# EasyEDA Pro project FOC_drive.epro, schematic Schematic9
Board Name: cbt6驱动; Create Date: 2025-10-11; Page Name: P1; Project Name: stm32g431_foc; Schematic Name: Schematic9; Update Date: 2025-10-11; Company: 嘉立创EDA; Page Size: A4; Version: V1.0
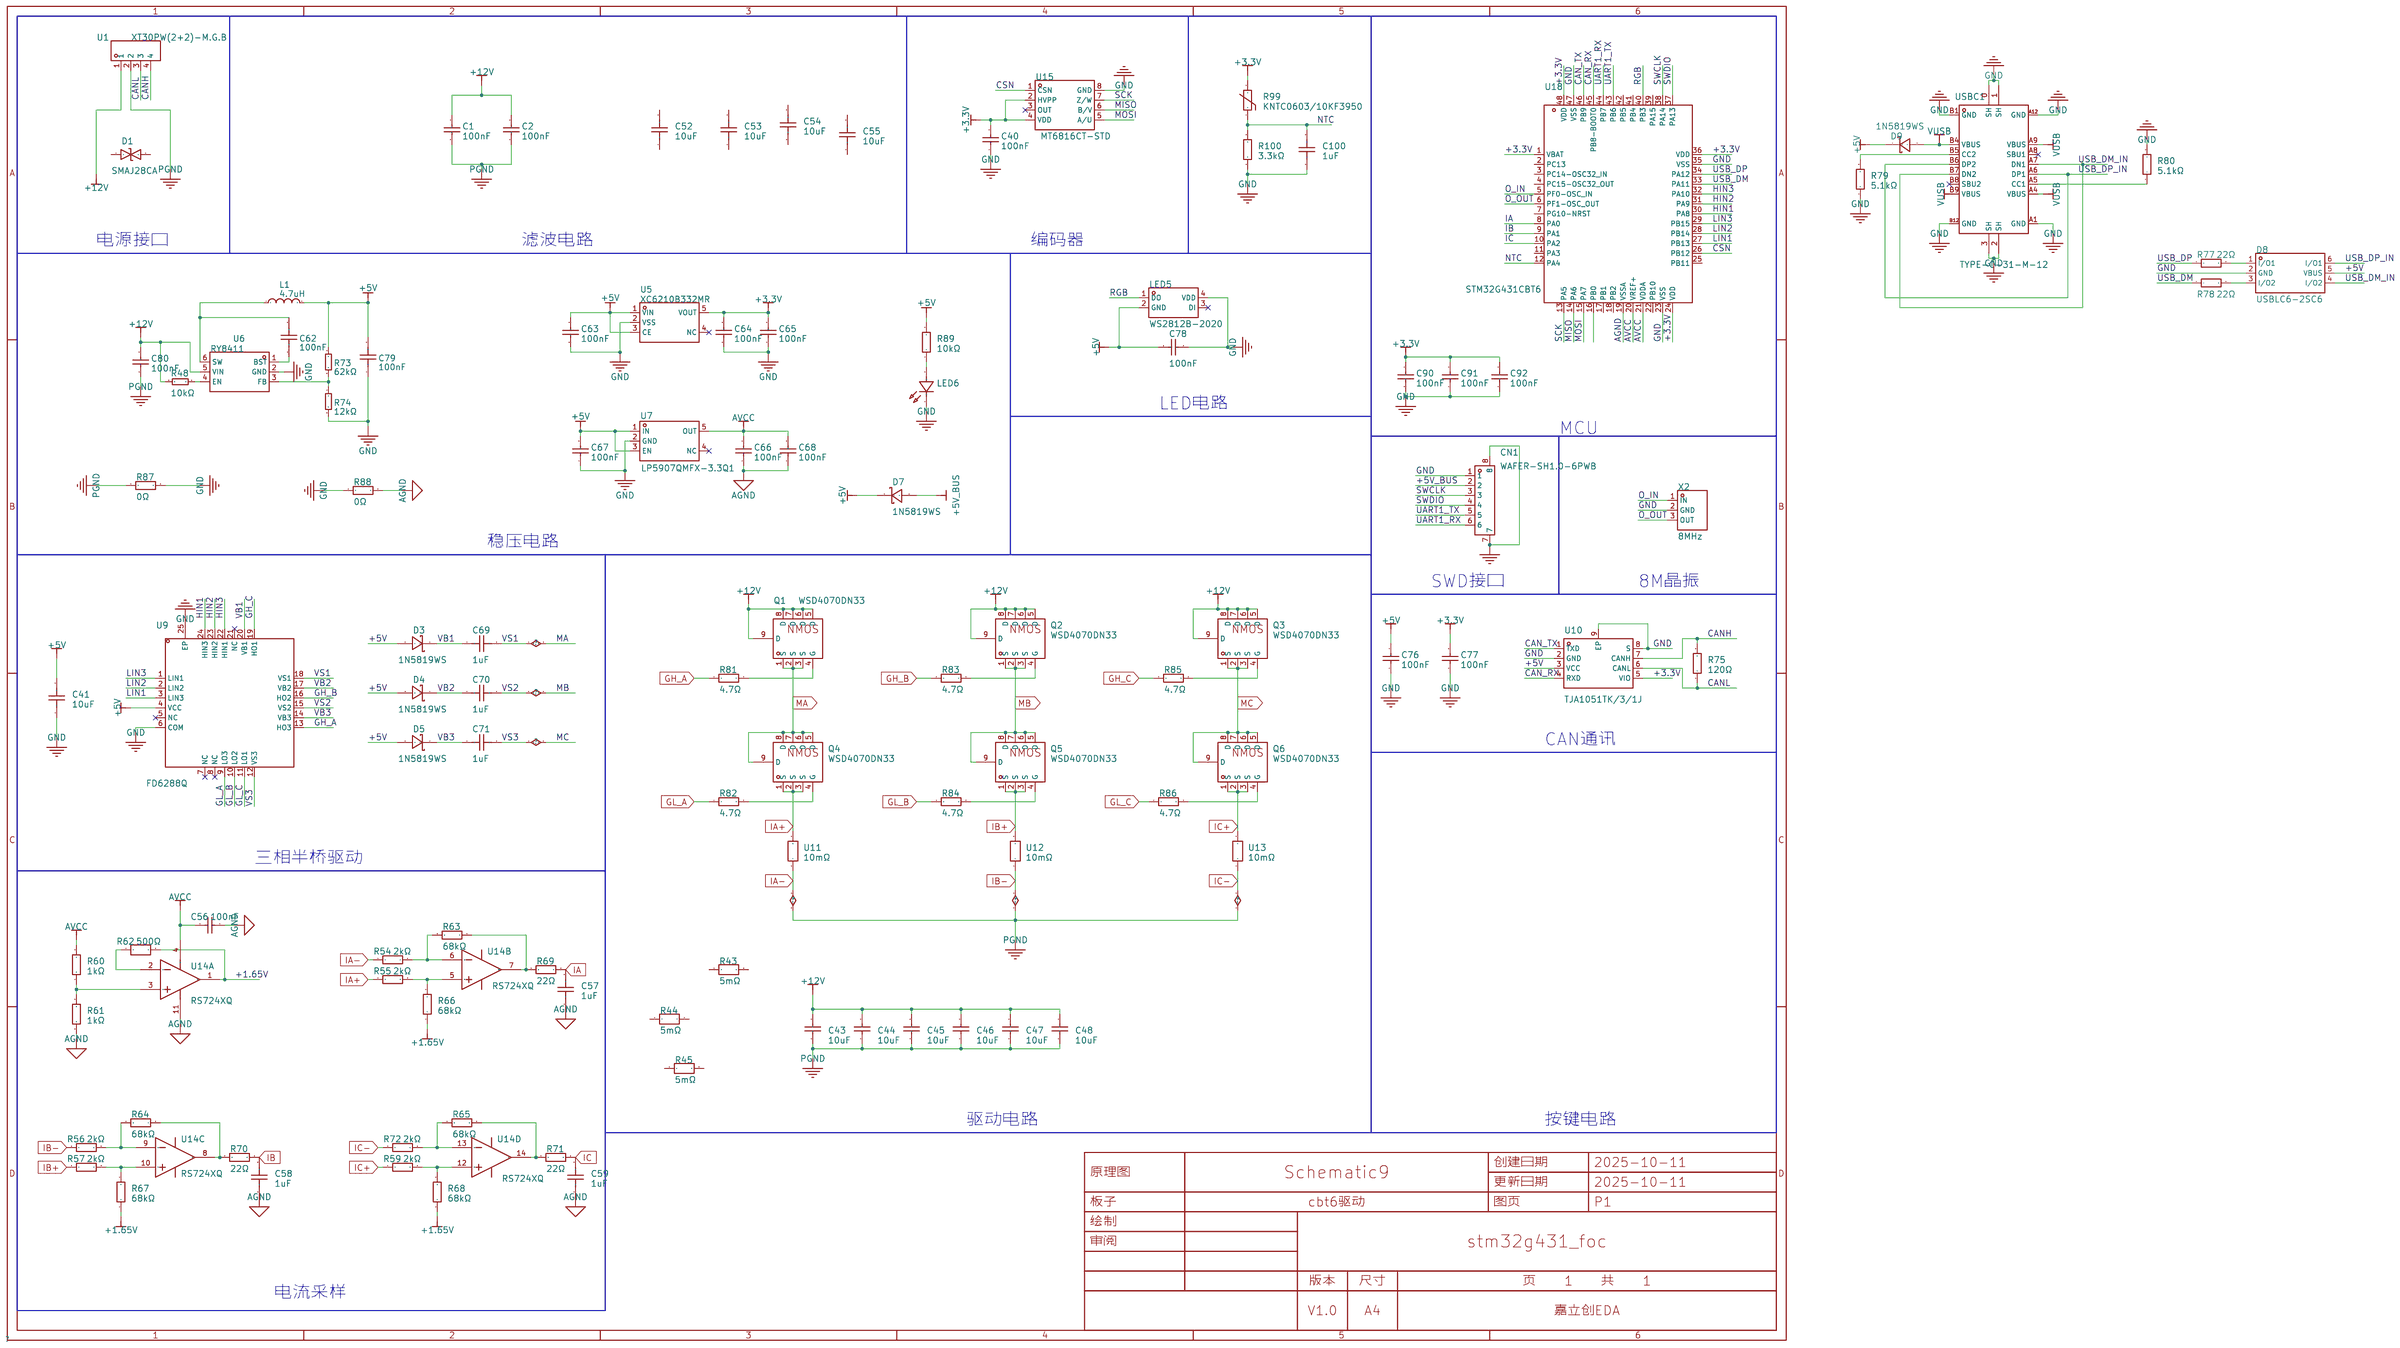
[diagram p0: schematic sheet]

## Parts
C1  100nF  [C0603_S]
C2  100nF  [C0603_S]
C40  100nF  [C0603_S]
C41  10uF  [C0603_S]
C43  10uF  [C1206_SMALL]
C44  10uF  [C1206_SMALL]
C45  10uF  [C1206_SMALL]
C46  10uF  [C1206_SMALL]
C47  10uF  [C1206_SMALL]
C48  10uF  [C1206_SMALL]
C52  10uF  [C1206]
C53  10uF  [C1206]
C54  10uF  [C1206]
C55  10uF  [C1206]
C56  100nF  [C0603_S]
C57  1uF  [C0603_S_1]
C58  1uF  [C0603_S_1]
C59  1uF  [C0603_S_1]
C62  100nF  [C0603_S_3]
C63  100nF  [C0603_S]
C64  100nF  [C0603_S]
C65  100nF  [C0603_S]
C66  100nF  [C0603_S]
C67  100nF  [C0603_S]
C68  100nF  [C0603_S]
C69  1uF  [C0603S]
C70  1uF  [C0603S]
C71  1uF  [C0603S]
C76  100nF  [C0603_S]
C77  100nF  [C0603_S]
C78  100nF  [C0603_S]
C79  100nF  [C0603_S_3]
C80  100nF  [C0603_S]
C90  100nF  [C0603_S]
C91  100nF  [C0603_S]
C92  100nF  [C0603_S]
C100  1uF  [C0603_S]
CN1  WAFER-SH1.0-6PWB  [CONN-SMD_6P-P1.00_XUNPU_WAFER-SH1.0-6PWB]
D1  SMAJ28CA  [SMA_L4.3-W2.5-LS5.0-BI]
D3  1N5819WS  [SOD-323_L1.8-W1.3-LS2.5-RD]
D4  1N5819WS  [SOD-323_L1.8-W1.3-LS2.5-RD]
D5  1N5819WS  [SOD-323_L1.8-W1.3-LS2.5-RD]
D7  1N5819WS  [SOD-323_L1.8-W1.3-LS2.5-RD]
D8  USBLC6-2SC6  [SOT-23-6_L2.9-W1.6-P0.95-LS2.8-BL]
D9  1N5819WS  [SOD-323_L1.8-W1.3-LS2.5-RD]
L1  4.7uH  [IND-SMD_L2.5-W2.0]
LED5  WS2812B-2020  [LED-SMD_4P-L2.0-W2.0-TL_WS2812B-2020]
LED6  XL-1608UBC-04  [LED0603-RD_BLUE]
Q1  WSD4070DN33  [PDFN3333-8_L3.1-W3.2-P0.65-LS3.4-BL]
Q2  WSD4070DN33  [PDFN3333-8_L3.1-W3.2-P0.65-LS3.4-BL]
Q3  WSD4070DN33  [PDFN3333-8_L3.1-W3.2-P0.65-LS3.4-BL]
Q4  WSD4070DN33  [PDFN3333-8_L3.1-W3.2-P0.65-LS3.4-BL]
Q5  WSD4070DN33  [PDFN3333-8_L3.1-W3.2-P0.65-LS3.4-BL]
Q6  WSD4070DN33  [PDFN3333-8_L3.1-W3.2-P0.65-LS3.4-BL]
R43  5mΩ  [R0805]
R44  5mΩ  [R0805]
R45  5mΩ  [R0805]
R48  10kΩ  [R0603_S]
R54  2kΩ  [R0603_S]
R55  2kΩ  [R0603_S]
R56  2kΩ  [R0603_S]
R57  2kΩ  [R0603_S]
R59  2kΩ  [R0603_S]
R60  1kΩ  [R0603_S]
R61  1kΩ  [R0603_S]
R62  500Ω  [R0603_S]
R63  68kΩ  [R0603_S]
R64  68kΩ  [R0603_S]
R65  68kΩ  [R0603_S]
R66  68kΩ  [R0603_S]
R67  68kΩ  [R0603_S]
R68  68kΩ  [R0603_S]
R69  22Ω  [R0603_S]
R70  22Ω  [R0603_S]
R71  22Ω  [R0603_S]
R72  2kΩ  [R0603_S]
R73  62kΩ  [R0603_S]
R74  12kΩ  [R0603_S]
R75  120Ω  [R0603_S]
R77  22Ω  [R0603_SMALL]
R78  22Ω  [R0603_SMALL]
R79  5.1kΩ  [R0603_SMALL]
R80  5.1kΩ  [R0603_SMALL]
R81  4.7Ω  [R0603_S]
R82  4.7Ω  [R0603_S]
R83  4.7Ω  [R0603_S]
R84  4.7Ω  [R0603_S]
R85  4.7Ω  [R0603_S]
R86  4.7Ω  [R0603_S]
R87  0Ω  [R0603_S]
R88  0Ω  [R0603_S]
R89  10kΩ  [R0603_SMALL]
R99  KNTC0603/10KF3950  [R0603_SMALL]
R100  3.3kΩ  [R0603_SMALL]
U1  XT30PW(2+2)-M.G.B  [CONN-TH_4P-XT30PW-M]
U5  XC6210B332MR  [SOT-23-5_L3.0-W1.7-P0.95-LS2.8-BR]
U6  RY8411  [SOT-23-6_L2.9-W1.6-P0.95-LS2.8-BR]
U7  LP5907QMFX-3.3Q1  [SOT-23-5_L3.0-W1.7-P0.95-LS2.8-BR]
U9  FD6288Q  [QFN-24_L4.0-W4.0-P0.50-BL-EP2.6]
U10  TJA1051TK/3/1J  [HVSON-8_L3.0-W3.0-P0.65-BL-EP]
U11  10mΩ  [R1206_SMALL]
U12  10mΩ  [R1206_SMALL]
U13  10mΩ  [R1206_SMALL]
U14  RS724XQ  [TSSOP-14_L5.0-W4.4-P0.65-LS6.4-BL]  (sections 1,2,3,4)
U15  MT6816CT-STD  [SOP-8_L4.9-W3.9-P1.27-LS6.0-BL]
U18  STM32G431CBT6  [LQFP-48_L7.0-W7.0-P0.50-LS9.0-BL]
USBC1  TYPE-C-31-M-12  [USB-C_SMD-TYPE-C-31-M-12]
X2  8MHz  [OSC-SMD_3P-L3.2-W1.3-P1.20]

## Library data of the parts
C1 C2 C40 C56 C63-C68 C76-C78 C80 C90-C92 = 0603B104K500NT: 容值:100nF;精度:±10%;额定电压:50V;材质(温度系数):X7R;; LCSC Part Name: 100nF ±10% 50V; Supplier Part: C30926; Manufacturer: FH(风华); Supplier Footprint: 0603; JLCPCB Part Class: Extended Part; Datasheet: https://atta.szlcsc.com/upload/public/pdf/source/20200305/C486355_26A10D38EF8C2A5C37091D0039909270.pdf; Supplier: LCSC; Tolerance: ±10%; Voltage Rated: 50V; Temperature Coefficient: X7R; Pin Type: IN; Check: true
C41 = CL10A106MA8NRNC: 容值:10uF;精度:±20%;额定电压:25V;材质(温度系数):X5R;; LCSC Part Name: 10uF ±20% 25V; Supplier Part: C96446; Manufacturer: SAMSUNG(三星); Supplier Footprint: 0603; JLCPCB Part Class: Basic Part; Datasheet: https://atta.szlcsc.com/upload/public/pdf/source/20160218/1457707763339.pdf; Supplier: LCSC; Tolerance: ±20%; Voltage Rated: 25V; Temperature Coefficient: X5R
C43-C48 = CL31A106KBHNNNE: 容值:10uF;精度:±10%;额定电压:50V;材质(温度系数):X5R;; LCSC Part Name: 10uF ±10% 50V; Supplier Part: C13585; Manufacturer: SAMSUNG(三星); Supplier Footprint: 1206; JLCPCB Part Class: 基础库; Datasheet: https://atta.szlcsc.com/upload/public/pdf/source/20160218/1457707763339.pdf; Supplier: LCSC; Tolerance: ±10%; Voltage Rated: 50V; Temperature Coefficient: X5R
C52-C55 = HGC1206R5106K500NSPJ: 容值:10uF;精度:±10%;额定电压:50V;材质(温度系数):X5R;; LCSC Part Name: 10uF ±10% 50V; Supplier Part: C7432781; Manufacturer: Chinocera(华瓷); Supplier Footprint: 1206; JLCPCB Part Class: 扩展库; Datasheet: https://atta.szlcsc.com/upload/public/pdf/source/20240320/FAC3FEC40A78BC5CCCE96C232A94D860.pdf; Supplier: LCSC; Tolerance: ±10%; Voltage Rated: 50V; Temperature Coefficient: X5R
C57-C59 C69-C71 = CL10A105KB8NNNC: 容值:1uF;精度:±10%;额定电压:50V;材质(温度系数):X5R;; LCSC Part Name: 1uF ±10% 50V; Supplier Part: C15849; Manufacturer: SAMSUNG(三星); Supplier Footprint: 0603; JLCPCB Part Class: 基础库; Datasheet: https://atta.szlcsc.com/upload/public/pdf/source/20160218/1457707763339.pdf; Supplier: LCSC; Tolerance: ±10%; Voltage Rated: 50V; Temperature Coefficient: X5R
C62 C79 = CC0603KRX7R9BB104: 容值:100nF;精度:±10%;额定电压:50V;材质(温度系数):X7R;; LCSC Part Name: 100nF ±10% 50V; Supplier Part: C14663; Manufacturer: YAGEO(国巨); Supplier Footprint: 0603; JLCPCB Part Class: 基础库; Datasheet: https://atta.szlcsc.com/upload/public/pdf/source/20180910/C282072_33301C7F631E79921B82A8DAC6BCC5B3.pdf; Supplier: LCSC; Tolerance: ±10%; Voltage Rated: 50V; Temperature Coefficient: X7R; Check: true
C100 = CGA0603X5R105K500JT: 容值:1uF;精度:±10%;额定电压:50V;温度系数:X5R;; LCSC Part Name: 1uF ±10% 50V; Supplier Part: C6119852; Manufacturer: HRE(芯声); Supplier Footprint: 0603; JLCPCB Part Class: 扩展库; Supplier: LCSC; Tolerance: ±10%; Voltage Rating: 50V; Temperature Coefficient: X5R
CN1 = WAFER-SH1.0-6PWB: 插针结构:1x6P;间距:1mm;安装方式:卧贴;总PIN数:6P;排数:1;每排PIN数:6;额定电流:1A;工作温度范围:-25℃~+85℃;; LCSC Part Name: 1x6P 间距:1mm 卧贴; Supplier Part: C3029345; Manufacturer: XUNPU(讯普); Supplier Footprint: SMD,P=1mm,卧贴; JLCPCB Part Class: 扩展库; Datasheet: https://atta.szlcsc.com/upload/public/pdf/source/20220527/1879B8210BD3B2006BCEAC1A40D397B6.pdf; Supplier: LCSC; Pins Structure: 1x6P; Pitch: 1mm; Mounting Style: 卧贴; Number of Pins: 6P; Number of Rows: 1; Number of PINs Per Row: 6; Current Rating (Max): 1A; Operating Temperature Range: -25℃~+85℃
D1 = SMAJ28CA_C353457: 反向截止电压(Vrwm):28V;最大钳位电压:45.4V;峰值脉冲电流(Ipp)@10/1000us:8.8A;击穿电压:31.1V;; LCSC Part Name: 双向TVS 28V截止 8.8A峰值脉冲; Supplier Part: C353457; Manufacturer: 晶导微电子; Supplier Footprint: SMA; JLCPCB Part Class: 扩展库; Datasheet: https://atta.szlcsc.com/upload/public/pdf/source/20190103/C353498_9C52E1B7CA7D9691073072057BB1DA1A.pdf; Supplier: LCSC; Reverse Stand-Off Voltage (Vrwm): 28V; Maximum Clamping Voltage: 45.4V; Peak Pulse Current (Ipp)@10/1000us: 8.8A; Breakdown Voltage: 31.1V; Reverse Leakage Current (Ir): 1uA; Type: TVS
D3-D5 D7 D9 = 1N5819WS_C191023: 正向压降(Vf):600mV@1A;直流反向耐压(Vr):40V;整流电流:1A;; LCSC Part Name: 电压:40V 电流:1A; Supplier Part: C191023; Manufacturer: Hottech(合科泰); Supplier Footprint: SOD-323; JLCPCB Part Class: 基础库; Datasheet: https://atta.szlcsc.com/upload/public/pdf/source/20220428/3CB86FD8D28D653594B4E35F9D5AEFD9.pdf; Supplier: LCSC; Forward Voltage (Vf@If): 600mV@1A; Reverse Voltage (Vr): 40V; Rectified Current: 1A
D8 = USBLC6-2SC6: 最大钳位电压:15V;击穿电压:6V;; Supplier Part: C2687116; Manufacturer: UMW(友台半导体); Supplier Footprint: SOT-23-6; JLCPCB Part Class: 扩展库; Datasheet: https://atta.szlcsc.com/upload/public/pdf/source/20231109/512642D850D9873E7C519F71E85B9A10.pdf; Supplier: LCSC; Maximum Clamping Voltage: 15V; Breakdown Voltage: 6V; Number of Lines: 双路; Type: ESD
L1 = MPIH252010-4R7M-LF: 电感值:4.7uH;精度:±20%;额定电流:1A;; LCSC Part Name: 4.7uH ±20% 1A 275mΩ; Supplier Part: C490449; Manufacturer: microgate(麦捷科技); Supplier Footprint: SMD; JLCPCB Part Class: Extended Part; Datasheet: https://atta.szlcsc.com/upload/public/pdf/source/20200707/C490443_2060EC88E48E101AE91DC68C352BCAF4.pdf; Supplier: LCSC; Tolerance: ±20%; Rated Current: 1A; DC Resistance (DCR): 275mΩ; Check: true
LED5 = WS2812B-2020: 12mA，小尺寸，高亮，用于小间距，小尺寸产品（注意防潮，请查阅规格书中对应具体内容）; LCSC Part Name: RGB三色; Supplier Part: C965555; Manufacturer: worldsemi; Supplier Footprint: SMD,2x2mm; JLCPCB Part Class: 扩展库; Datasheet: https://atta.szlcsc.com/upload/public/pdf/source/20241202/DEE3FC25B8AD87F3BB1718ACD77EDECD.pdf; Supplier: LCSC; Wavelength: 515.6nm；622.5nm；470.4nm
LED6 = XL-1608UBC-04: 发光颜色:蓝色;功率:80mW;正向电流:25mA;主波长:460nm~469nm;透镜颜色:无色透明透镜;色温:-;发光角度:120°;载带方式:正贴;工作温度:-30℃~+85℃;; Supplier Part: C965807; Manufacturer: XINGLIGHT(成兴光); Supplier Footprint: 0603; JLCPCB Part Class: 扩展库; Datasheet: https://atta.szlcsc.com/upload/public/pdf/source/20240218/F76B043D1CDACE9DB8357580572EF0D5.pdf; Supplier: LCSC; Emitted Color: 蓝色; Power Dissipation: 80mW; Forward Current: 25mA; Dominant Wavelength: 460nm~469nm; Peak Wavelength: 475nm; Lens Color: 无色透明透镜; Viewing Angle: 120°; Mounting Sytle: 正贴; Operating Temperature: -30℃~+85℃
Q1-Q6 = WSD4070DN33: 类型:1个N沟道;漏源电压(Vdss):40V;连续漏极电流(Id):68A;导通电阻(RDS(on)@Vgs,Id):4.5mΩ@10V,7A;功率:3.1W;阈值电压(Vgs(th)@Id):1.9V@250uA;; LCSC Part Name: 1个N沟道 耐压:40V 电流:68A; Supplier Part: C719095; Manufacturer: WINSOK(微硕); Supplier Footprint: PDFN3333-8; JLCPCB Part Class: 扩展库; Datasheet: https://atta.szlcsc.com/upload/public/pdf/source/20240611/C3187B854891BFB7BDFB624E9267BA1F.pdf; Supplier: LCSC; Type: 1个N沟道; Drain Source Voltage (Vdss): 40V; Continuous Drain Current (Id): 68A; Drain Source On Resistance (RDS(on)@Vgs,Id): 4.5mΩ@10V,7A; Power Dissipation (Pd): 3.1W; Gate Threshold Voltage (Vgs(th)@Id): 1.9V@250uA; Total Gate Charge (Qg@Vgs): 28nC@10V; Input Capacitance (Ciss@Vds): 2.42nF@20V; Reverse Transfer Capacitance (Crss@Vds): 150pF@20V; Operating Temperature: -55℃~+150℃@(Tj)
R43-R45 = PA0805FRE470R005L: 阻值:5mΩ;精度:±1%;功率:500mW;温度系数:±50ppm/℃;; LCSC Part Name: 5mΩ ±1% 500mW; Supplier Part: C728267; Manufacturer: YAGEO(国巨); Supplier Footprint: 0805; JLCPCB Part Class: 扩展库; Datasheet: https://atta.szlcsc.com/upload/public/pdf/source/20200824/C728267_9300DEE0E0EB6D7A4F794A41060EC95A.pdf; Supplier: LCSC; Tolerance: ±1%; Power(Watts): 500mW; Temperature Coefficient: ±50ppm/℃; Operating Temperature Range: -55℃~+155℃
R48 = 0603WAF1002T5E: 电阻类型:厚膜电阻;阻值:10kΩ;精度:±1%;功率:100mW;最大工作电压:75V;温度系数:±100ppm/℃;; LCSC Part Name: 厚膜电阻 10kΩ ±1% 100mW; Supplier Part: C25804; Manufacturer: UNI-ROYAL(厚声); Supplier Footprint: 0603; JLCPCB Part Class: 基础库; Datasheet: https://atta.szlcsc.com/upload/public/pdf/source/20200306/C422600_1E6D84923E4A46A82E41ADD87F860B5C.pdf; Supplier: LCSC; Type: 厚膜电阻; Tolerance: ±1%; Power(Watts): 100mW; Overload Voltage (Max): 75V; Temperature Coefficient: ±100ppm/℃; Operating Temperature Range: -55℃~+155℃; Pin Type: IN; Check: true
R54-R57 R59 R72 = 0603WAF2001T5E: 电阻类型:厚膜电阻;阻值:2kΩ;精度:±1%;功率:100mW;最大工作电压:75V;温度系数:±100ppm/℃;; LCSC Part Name: 2kΩ ±1% 100mW 厚膜电阻; Supplier Part: C22975; Manufacturer: UNI-ROYAL(厚声); Supplier Footprint: 0603; JLCPCB Part Class: 基础库; Datasheet: https://atta.szlcsc.com/upload/public/pdf/source/20200306/C422600_1E6D84923E4A46A82E41ADD87F860B5C.pdf; Supplier: LCSC; Type: 厚膜电阻; Tolerance: ±1%; Power(Watts): 100mW; Overload Voltage (Max): 75V; Temperature Coefficient: ±100ppm/℃; Operating Temperature Range: -55℃~+155℃
R60 R61 = 0603WAF1001T5E: 电阻类型:厚膜电阻;阻值:1kΩ;精度:±1%;功率:100mW;最大工作电压:75V;温度系数:±100ppm/℃;; LCSC Part Name: 1kΩ ±1% 100mW 厚膜电阻; Supplier Part: C21190; Manufacturer: UNI-ROYAL(厚声); Supplier Footprint: 0603; JLCPCB Part Class: Basic Part; Datasheet: https://atta.szlcsc.com/upload/public/pdf/source/20200306/C422600_1E6D84923E4A46A82E41ADD87F860B5C.pdf; Supplier: LCSC; Type: 厚膜电阻; Tolerance: ±1%; Power(Watts): 100mW; Overload Voltage (Max): 75V; Temperature Coefficient: ±100ppm/℃; Operating Temperature Range: -55℃~+155℃
R62 = RT0603BRC07500RL: 电阻类型:薄膜电阻;阻值:500Ω;精度:±0.1%;功率:100mW;温度系数:±15ppm/℃;; LCSC Part Name: 薄膜电阻 500Ω ±0.1% 100mW; Supplier Part: C860931; Manufacturer: YAGEO(国巨); Supplier Footprint: 0603; JLCPCB Part Class: 扩展库; Supplier: LCSC; Type: 薄膜电阻; Tolerance: ±0.1%; Power(Watts): 100mW; Temperature Coefficient: ±15ppm/℃; Operating Temperature Range: -55℃~+155℃
R63-R68 = 0603WAF6802T5E: 电阻类型:厚膜电阻;阻值:68kΩ;精度:±1%;功率:100mW;最大工作电压:75V;温度系数:±100ppm/℃;; LCSC Part Name: 68kΩ ±1% 100mW 厚膜电阻; Supplier Part: C23231; Manufacturer: UNI-ROYAL(厚声); Supplier Footprint: 0603; JLCPCB Part Class: 基础库; Datasheet: https://atta.szlcsc.com/upload/public/pdf/source/20200306/C422600_1E6D84923E4A46A82E41ADD87F860B5C.pdf; Supplier: LCSC; Type: 厚膜电阻; Tolerance: ±1%; Power(Watts): 100mW; Overload Voltage (Max): 75V; Temperature Coefficient: ±100ppm/℃; Operating Temperature Range: -55℃~+155℃
R69-R71 R77 R78 = 0603WAF220JT5E: 电阻类型:厚膜电阻;阻值:22Ω;精度:±1%;功率:100mW;最大工作电压:75V;温度系数:±100ppm/℃;; LCSC Part Name: 22Ω ±1% 100mW 厚膜电阻; Supplier Part: C23345; Manufacturer: UNI-ROYAL(厚声); Supplier Footprint: 0603; JLCPCB Part Class: 基础库; Datasheet: https://atta.szlcsc.com/upload/public/pdf/source/20200306/C422600_1E6D84923E4A46A82E41ADD87F860B5C.pdf; Supplier: LCSC; Type: 厚膜电阻; Tolerance: ±1%; Power(Watts): 100mW; Overload Voltage (Max): 75V; Temperature Coefficient: ±100ppm/℃; Operating Temperature Range: -55℃~+155℃
R73 = 0603WAF6202T5E: 阻值:62kΩ;精度:±1%;功率:100mW;温度系数:±100ppm/℃;电阻类型:厚膜电阻;; LCSC Part Name: 62kΩ ±1% 100mW 厚膜电阻; Supplier Part: C23221; Manufacturer: UNI-ROYAL(厚声); Supplier Footprint: 0603; JLCPCB Part Class: Basic Part; Datasheet: https://atta.szlcsc.com/upload/public/pdf/source/20200306/C422600_1E6D84923E4A46A82E41ADD87F860B5C.pdf; Supplier: LCSC; Tolerance: ±1%; Power(Watts): 100mW; Overload Voltage (Max): 75V; Temperature Coefficient: ±100ppm/℃; Type: 厚膜电阻; Operating Temperature Range: -55℃~+155℃; Pin Type: IN; 美岩编码: A00010; 单价: 0.009222; Check: true
R74 = 0603WAF1202T5E: 阻值:12kΩ;精度:±1%;功率:100mW;温度系数:±100ppm/℃;电阻类型:厚膜电阻;; LCSC Part Name: 12kΩ ±1% 100mW 厚膜电阻; Supplier Part: C22790; Manufacturer: UNI-ROYAL(厚声); Supplier Footprint: 0603; JLCPCB Part Class: Basic Part; Datasheet: https://atta.szlcsc.com/upload/public/pdf/source/20200306/C422600_1E6D84923E4A46A82E41ADD87F860B5C.pdf; Supplier: LCSC; Tolerance: ±1%; Power(Watts): 100mW; Overload Voltage (Max): 75V; Temperature Coefficient: ±100ppm/℃; Type: 厚膜电阻; Operating Temperature Range: -55℃~+155℃; Pin Type: IN; 美岩编码: A00010; 单价: 0.009222; Check: true
R75 = 0603WAF1200T5E: 电阻类型:厚膜电阻;阻值:120Ω;精度:±1%;功率:100mW;最大工作电压:75V;温度系数:±100ppm/℃;; LCSC Part Name: 120Ω ±1% 100mW 厚膜电阻; Supplier Part: C22787; Manufacturer: UNI-ROYAL(厚声); Supplier Footprint: 0603; JLCPCB Part Class: 基础库; Datasheet: https://atta.szlcsc.com/upload/public/pdf/source/20200306/C422600_1E6D84923E4A46A82E41ADD87F860B5C.pdf; Supplier: LCSC; Type: 厚膜电阻; Tolerance: ±1%; Power(Watts): 100mW; Overload Voltage (Max): 75V; Temperature Coefficient: ±100ppm/℃; Operating Temperature Range: -55℃~+155℃
R79 R80 = 0603WAF5101T5E: 电阻类型:厚膜电阻;阻值:5.1kΩ;精度:±1%;功率:100mW;最大工作电压:75V;温度系数:±100ppm/℃;; LCSC Part Name: 5.1kΩ ±1% 100mW 厚膜电阻; Supplier Part: C23186; Manufacturer: UNI-ROYAL(厚声); Supplier Footprint: 0603; JLCPCB Part Class: 基础库; Datasheet: https://atta.szlcsc.com/upload/public/pdf/source/20200306/C422600_1E6D84923E4A46A82E41ADD87F860B5C.pdf; Supplier: LCSC; Type: 厚膜电阻; Tolerance: ±1%; Power(Watts): 100mW; Overload Voltage (Max): 75V; Temperature Coefficient: ±100ppm/℃; Operating Temperature Range: -55℃~+155℃
R81-R86 = 0603WAF470KT5E: 电阻类型:厚膜电阻;阻值:4.7Ω;精度:±1%;功率:100mW;最大工作电压:75V;温度系数:±400ppm/℃;; LCSC Part Name: 4.7Ω ±1% 100mW 厚膜电阻; Supplier Part: C23164; Manufacturer: UNI-ROYAL(厚声); Supplier Footprint: 0603; JLCPCB Part Class: 基础库; Datasheet: https://atta.szlcsc.com/upload/public/pdf/source/20200306/C422600_1E6D84923E4A46A82E41ADD87F860B5C.pdf; Supplier: LCSC; Type: 厚膜电阻; Tolerance: ±1%; Power(Watts): 100mW; Overload Voltage (Max): 75V; Temperature Coefficient: ±400ppm/℃; Operating Temperature Range: -55℃~+155℃
R87 R88 = 0603WAF0000T5E: 电阻类型:厚膜电阻;阻值:0Ω;精度:±1%;功率:100mW;最大工作电压:75V;; LCSC Part Name: 0Ω ±1% 100mW 厚膜电阻; Supplier Part: C21189; Manufacturer: UNI-ROYAL(厚声); Supplier Footprint: 0603; JLCPCB Part Class: 基础库; Datasheet: https://atta.szlcsc.com/upload/public/pdf/source/20200306/C422600_1E6D84923E4A46A82E41ADD87F860B5C.pdf; Supplier: LCSC; Type: 厚膜电阻; Tolerance: ±1%; Power(Watts): 100mW; Overload Voltage (Max): 75V; Operating Temperature Range: -55℃~+155℃
R89 = 0603WAF1002T5E: 电阻类型:厚膜电阻;阻值:10kΩ;精度:±1%;功率:100mW;最大工作电压:75V;温度系数:±100ppm/℃;; LCSC Part Name: 厚膜电阻 10kΩ ±1% 100mW; Supplier Part: C25804; Manufacturer: UNI-ROYAL(厚声); Supplier Footprint: 0603; JLCPCB Part Class: 基础库; Datasheet: https://atta.szlcsc.com/upload/public/pdf/source/20200306/C422600_1E6D84923E4A46A82E41ADD87F860B5C.pdf; Supplier: LCSC; Type: 厚膜电阻; Tolerance: ±1%; Power(Watts): 100mW; Overload Voltage (Max): 75V; Temperature Coefficient: ±100ppm/℃; Operating Temperature Range: -55℃~+155℃
R99 = KNTC0603/10KF3950: 阻值:10kΩ;B值(25℃/50℃):3950K;功率:100mW;B值精度:±1%;最大稳态电流(25℃):310uA;; Supplier Part: C2892547; Manufacturer: KUU; Supplier Footprint: 0603; JLCPCB Part Class: 扩展库; Datasheet: https://atta.szlcsc.com/upload/public/pdf/source/20210908/154E92DD1F52D9B3804AA862EC2D5FAB.pdf; Supplier: LCSC; Resistance @ 25℃: 10kΩ; B Constant (25℃/50℃): 3950K; B Constant (25℃/85℃): 3987K; Power(Watts): 100mW; B Constant Tolerance: ±1%; Steady State Current (Max): 310uA; Operating Temperature: -40℃~+125℃
R100 = RC0603FR-073K3L: 电阻类型:厚膜电阻;阻值:3.3kΩ;精度:±1%;功率:100mW;最大工作电压:75V;温度系数:±100ppm/℃;; LCSC Part Name: 厚膜电阻 3.3kΩ ±1% 100mW; Supplier Part: C108078; Manufacturer: YAGEO(国巨); Supplier Footprint: 0603; JLCPCB Part Class: 扩展库; Datasheet: https://atta.szlcsc.com/upload/public/pdf/source/20180821/C275644_0D56F95EFF785E7D9A1FEF436B37DA78.pdf; Supplier: LCSC; Type: 厚膜电阻; Tolerance: ±1%; Power(Watts): 100mW; Overload Voltage (Max): 75V; Temperature Coefficient: ±100ppm/℃; Operating Temperature Range: -55℃~+155℃
U1 = XT30PW(2+2)-M.G.B: LCSC Part Name: XT30PW(2+2)功率数据混合插头公金黑PCB弯插; Supplier Part: C19268030; Manufacturer: AMASS(艾迈斯); JLCPCB Part Class: 扩展库; Datasheet: https://atta.szlcsc.com/upload/public/pdf/source/20240112/A815AE62CB016131F8636555ECBDABF7.pdf; Supplier: LCSC
U5 = XC6210B332MR_C424705: 输出类型:固定;输出极性:正;最大输入电压:6V;输出电压:3.3V;输出电流:900mA;电源纹波抑制比(PSRR):60dB@(1kHz);; Supplier Part: C424705; Manufacturer: TOREX(特瑞仕); Supplier Footprint: SOT-25; JLCPCB Part Class: Extended Part; Datasheet: https://atta.szlcsc.com/upload/public/pdf/source/20190903/C424705_1DFB2113A9A78D399905DBF688657204.pdf; Supplier: LCSC; Output Type: 固定; Output Polarity: 正; Number of Outputs: 1; Maximum Input Voltage: 6V; Output Voltage: 3.3V; Dropout Voltage: 75mV@(100mA); Output Current: 900mA; Power Supply Rejection Ratio (PSRR): 60dB@(1kHz); Power Supply Rejection Ratio (PRSS): 90dB@(100Hz),60dB@(100kHz); Check: true
U6 = TD1466: Supplier: LCSC; Supplier Part: C185109; Manufacturer: JoulWatt Tech; Manufacturer Part: JW5026; JLCPCB Part Class: Extended Part; Check: true
U7 = LP5907QMFX-3.3Q1: 输出类型:固定;输出极性:正;最大输入电压:5.5V;输出电压:3.3V;输出电流:250mA;电源纹波抑制比(PSRR):90dB;; Supplier Part: C130005; Manufacturer: TI(德州仪器); Supplier Footprint: SOT-23-5; JLCPCB Part Class: Extended Part; Datasheet: https://atta.szlcsc.com/upload/public/pdf/source/20170918/C130005_1505703244961975089.pdf; Supplier: LCSC; Output Type: 固定; Output Polarity: 正; Number of Outputs: 1; Maximum Input Voltage: 5.5V; Output Voltage: 3.3V; Dropout Voltage: 250mV@(250mA); Output Current: 250mA; Power Supply Rejection Ratio (PSRR): 90dB; Power Supply Rejection Ratio (PRSS): 90dB@(100Hz),60dB@(100kHz); Check: true
U9 = FD6288Q: Supplier Part: C328453; Manufacturer: Fortior Tech(峰岹); Supplier Footprint: QFN-24-EP(4x4); JLCPCB Part Class: 扩展库; Datasheet: https://atta.szlcsc.com/upload/public/pdf/source/20241101/0E2856EB301EAFFED732065FB088D773.pdf; Supplier: LCSC
U10 = TJA1051TK/3/1J: 类型:CAN收发器;数据速率:5Mbps;; Supplier Part: C2875699; Manufacturer: NXP(恩智浦); Supplier Footprint: HVSON-8-EP(3x3); JLCPCB Part Class: 扩展库; Datasheet: https://www.nxp.com/docs/en/data-sheet/TJA1051.pdf; Supplier: LCSC; Type: CAN收发器; Data Rate: 5Mbps; Supply Voltage: 4.5V~5.5V; Supply Current: 70mA; Operating Temperature: -40℃~+150℃
U11-U13 = FRM121WFR010TM: 电阻类型:采样电阻;阻值:10mΩ;精度:±1%;额定压降:-;功率:1W;温度系数:±50ppm/℃;安装方式:-;; LCSC Part Name: 10mΩ ±1% 1W; Supplier Part: C7467248; Manufacturer: FOJAN(富捷); Supplier Footprint: 1206; JLCPCB Part Class: 扩展库; Datasheet: https://atta.szlcsc.com/upload/public/pdf/source/20240709/7FCE84187288C94C67B1004F90EDDF14.pdf; Supplier: LCSC; Type: 采样电阻; Tolerance: ±1%; Power(Watts): 1W; Temperature Coefficient: ±50ppm/℃
U14 = RS724XQ: 放大器数:四路;增益带宽积(GBP):10MHz;输入偏置电流(Ib):1pA;压摆率(SR):7V/us;带宽(-3db):-;轨到轨:-;; LCSC Part Name: 低噪声运放RS724XQ; Supplier Part: C255447; Manufacturer: RUNIC(润石); Supplier Footprint: TSSOP-14; JLCPCB Part Class: 扩展库; Datasheet: https://atta.szlcsc.com/upload/public/pdf/source/20180801/C255450_768C14DB83EE3551614887CE51AFCCB3.pdf; Supplier: LCSC; Number of Circuits: 四路; Gain Bandwidth Product(GBP): 10MHz; Current - Input Bias(Ib): 1pA; Slew Rate(SR): 7V/us; Output Current: 70mA; Operating Temperature: -40℃~+125℃
U15 = MT6816CT-STD: 零延迟磁角位置传感器IC; LCSC Part Name: 磁位置传感器; Supplier Part: C2925077; Manufacturer: MagnTek(麦歌恩); Supplier Footprint: SOP-8; JLCPCB Part Class: 扩展库; Datasheet: https://atta.szlcsc.com/upload/public/pdf/source/20211202/34073ED58EE6E476BE477C7F05608C83.pdf; Supplier: LCSC
U18 = STM32G431CBT6: CPU内核:-;程序存储容量:128KB;RAM总容量:32KB;GPIO端口数量:38;工作电压范围:1.71V~3.6V;CPU最大主频:170MHz;程序存储器类型:FLASH;; LCSC Part Name: 带DSP和FPU的170MHz主流ARM Cortex-M4 MCU，具有128 KB Flash存储器、数学加速器和中等模拟电平集成; Supplier Part: C529355; Manufacturer: ST(意法半导体); Supplier Footprint: LQFP-48(7x7); JLCPCB Part Class: 扩展库; Datasheet: https://atta.szlcsc.com/upload/public/pdf/source/20200511/C529354_7C66CF00837B904D0C15DCE45B69418C.pdf; Supplier: LCSC; Program Storage Size: 128KB; RAM Size: 32KB; GPIO Ports Number: 38; Operating Voltage Range: 1.71V~3.6V; CPU Maximum Speed: 170MHz; Program Memory Type: FLASH; Operating Temperature Range: -40℃~+85℃; ADC (Bit): 12bit; DAC (Bit): 12bit; Peripheral/Function: DMA；PWM; Watchdog: 有; Infrared Data Association: 有; Low-Voltage Detect: 有; Direct Memory Access: 有; Internal Oscillator: 有
USBC1 = TYPE-C-31-M-12: 连接器类型:Type-C;标准:-;公母:母;安装方式:-;触点数量:16P;端口数量:1;额定电流 - 电源:5A;工作温度范围:-;; LCSC Part Name: Type-C 母; Supplier Part: C165948; Manufacturer: 韩国韩荣; Supplier Footprint: SMD; JLCPCB Part Class: 扩展库; Datasheet: https://atta.szlcsc.com/upload/public/pdf/source/20220525/466408E853115E789EDB0DDC29077C05.pdf; Supplier: LCSC; Connector Type: Type-C; Gender: 母; Number of Contacts: 16P; Number of Ports: 1; Current Rating - Power (Max): 5A
X2 = CSTNE8M00G520000R0: 频率:8MHz;内置负载电容:10pF;谐振阻抗:40Ω;; LCSC Part Name: 8MHz ±0.5% 内置负载电容:10pF; Supplier Part: C907975; Manufacturer: muRata(村田); Supplier Footprint: SMD3213-3P; JLCPCB Part Class: 扩展库; Datasheet: https://atta.szlcsc.com/upload/public/pdf/source/20201022/C907975_BE77A173E35C03920A12013DDB2B8858.pdf; Supplier: LCSC; Built-in Load Capacitance: 10pF; Resonant Impedance: 40Ω; Operating Temperature: -40℃~+85℃

## Nets
+1.65V: R62.2 R66.1 R67.1 R68.1 U14.1(OUTA)
+3.3V: C40.2 C64.2 C65.2 C77.2 C90.2 C91.2 C92.2 R99.2 U5.5(VOUT) U10.5(VIO) U15.2(HVPP) U15.4(VDD) U18.1(VBAT) U18.24(VDD) U18.36(VDD) U18.48(VDD)
+5V: C41.2 C63.2 C67.2 C76.2 C78.2 C79.2 D3.2(A) D4.2(A) D5.2(A) D7.1(K) D8.5(VBUS) D9.1(K) L1.2 LED5.2(GND) R73.1 R89.2 U5.1(VIN) U5.3(CE) U7.1(IN) U7.3(EN) U9.4(VCC) U10.3(VCC)
+5V_BUS: CN1.2 D7.2(A)
+12V: C1.2 C2.2 C43.2 C44.2 C45.2 C46.2 C47.2 C48.2 C80.2 Q1.5(D) Q1.6(D) Q1.7(D) Q1.8(D) Q1.9(D) Q2.5(D) Q2.6(D) Q2.7(D) Q2.8(D) Q2.9(D) Q3.5(D) Q3.6(D) Q3.7(D) Q3.8(D) Q3.9(D) R48.2 U1.1 U6.5(VIN)
AGND: C56.1 C57.1 C58.1 C59.1 C66.1 C68.1 R61.1 R88.2 U14.11(V-) U18.19(VSSA)
AVCC: C56.2 C66.2 C68.2 R60.2 U7.5(OUT) U14.4(V+) U18.20(VREF+) U18.21(VDDA)
GND: C40.1 C41.1 C63.1 C64.1 C65.1 C67.1 C76.1 C77.1 C78.1 C79.1 C90.1 C91.1 C92.1 C100.1 CN1.1 CN1.7 CN1.8 D8.2(GND) LED5.4(VDD) LED6.1(K) R74.2 R79.1 R80.2 R87.2 R88.1 R100.1 U5.2(VSS) U6.2(GND) U7.2(GND) U9.6(COM) U9.25(EP) U10.2(GND) U10.8(S) U10.9(EP) U15.8(GND) U18.23(VSS) U18.35(VSS) U18.47(VSS) USBC1.0(SH) USBC1.1(SH) USBC1.2(SH) USBC1.3(SH) USBC1.A1(GND) USBC1.A12(GND) USBC1.B1(GND) USBC1.B12(GND) X2.2(GND)
PGND: C1.1 C2.1 C43.1 C44.1 C45.1 C46.1 C47.1 C48.1 C80.1 R54.1 R56.1 R72.1 R87.1 U1.2 U11.1 U12.1 U13.1
CAN_RX: U10.4(RXD) U18.45(PB8-BOOT0)
CAN_TX: U10.1(TXD) U18.46(PB9)
CANH: R75.2 U1.4 U10.7(CANH)
CANL: R75.1 U1.3 U10.6(CANL)
CSN: U15.1(CSN) U18.26(PB12)
GH_A: R81.1 U9.13(HO3)
GH_B: R83.1 U9.16(HO2)
GH_C: R85.1 U9.19(HO1)
GL_A: R82.1 U9.9(LO3)
GL_B: R84.1 U9.10(LO2)
GL_C: R86.1 U9.11(LO1)
HIN1: U9.24(HIN3) U18.30(PA8)
HIN2: U9.23(HIN2) U18.31(PA9)
HIN3: U9.22(HIN1) U18.32(PA10)
IA: C57.2 R69.2 U18.8(PA0)
IA+: Q4.1(S) Q4.2(S) Q4.3(S) R55.1 U11.2
IB: C58.2 R70.2 U18.9(PA1)
IB+: Q5.1(S) Q5.2(S) Q5.3(S) R57.1 U12.2
IC: C59.2 R71.2 U18.10(PA2)
IC+: Q6.1(S) Q6.2(S) Q6.3(S) R59.1 U13.2
LIN1: U9.3(LIN3) U18.27(PB13)
LIN2: U9.2(LIN2) U18.28(PB14)
LIN3: U9.1(LIN1) U18.29(PB15)
MA: C69.2 Q1.1(S) Q1.2(S) Q1.3(S) Q4.5(D) Q4.6(D) Q4.7(D) Q4.8(D) Q4.9(D) U9.18(VS1)
MB: C70.2 Q2.1(S) Q2.2(S) Q2.3(S) Q5.5(D) Q5.6(D) Q5.7(D) Q5.8(D) Q5.9(D) U9.15(VS2)
MC: C71.2 Q3.1(S) Q3.2(S) Q3.3(S) Q6.5(D) Q6.6(D) Q6.7(D) Q6.8(D) Q6.9(D) U9.12(VS3)
MISO: U15.6(B/V) U18.14(PA6)
MOSI: U15.5(A/U) U18.15(PA7)
NTC: C100.2 R99.1 R100.2 U18.12(PA4)
O_IN: U18.5(PF0-OSC_IN) X2.1(IN)
O_OUT: U18.6(PF1-OSC_OUT) X2.3(OUT)
RGB: LED5.1(DO) U18.40(PB3)
SCK: U15.7(Z/W) U18.13(PA5)
SWCLK: CN1.3 U18.38(PA14)
SWDIO: CN1.4 U18.37(PA13)
UART1_RX: CN1.6 U18.44(PB7)
UART1_TX: CN1.5 U18.43(PB6)
USB_DM: R78.1 U18.33(PA11)
USB_DM_IN: D8.4(I/O2) USBC1.A7(DN1) USBC1.B7(DN2)
USB_DP: R77.1 U18.34(PA12)
USB_DP_IN: D8.6(I/O1) USBC1.A6(DP1) USBC1.B6(DP2)
VB1: C69.1 D3.1(K) U9.20(VB1)
VB2: C70.1 D4.1(K) U9.17(VB2)
VB3: C71.1 D5.1(K) U9.14(VB3)
VUSB: D9.2(A) USBC1.A4(VBUS) USBC1.A9(VBUS) USBC1.B4(VBUS) USBC1.B9(VBUS)
$1N5464: R73.2 R74.1 U6.3(FB)
$1N5465: C62.2 L1.1 U6.6(SW)
$1N5466: C62.1 U6.1(BST)
$1N5543: R54.2 R63.2 U14.6(-INB)
$1N5544: R55.2 R66.2 U14.5(+INB)
$1N5545: R63.1 R69.1 U14.7(OUTB)
$1N5549: R56.2 R64.2 U14.9(-INC)
$1N5552: R64.1 R70.1 U14.8(OUTC)
$1N5554: R65.2 R72.2 U14.13(-IND)
$1N5555: R59.2 R68.2 U14.12(+IND)
$1N5557: R65.1 R71.1 U14.14(OUTD)
$1N5608: Q4.4(G) R82.2
$1N5612: Q2.4(G) R83.2
$1N5614: Q5.4(G) R84.2
$1N5617: Q3.4(G) R85.2
$1N5619: Q6.4(G) R86.2
$1N5625: R60.1 R61.2 U14.3(+INA)
$1N5641: Q1.4(G) R81.2
$1N5644: R62.1 U14.2(-INA)
$1N10412: D8.1(I/O1) R77.2
$1N10416: D8.3(I/O2) R78.2
$1N15779: R57.2 R67.2 U14.10(+INC)
$1N40669: R48.1 U6.4(EN)
Net-(LED6-2): LED6.2(A) R89.1
Net-(R79-2): R79.2 USBC1.B5(CC2)
Net-(R80-1): R80.1 USBC1.A5(CC1)

Not connected (* = marked no-connect by the designer): C52 1 2; C53 1 2; C54 1 2; C55 1 2; D1 1 2; LED5 3(DI)*; R43 1 2; R44 1 2; R45 1 2; U5 4(NC)*; U7 4(NC)*; U9 5(NC)* 7(NC)* 8(NC)* 21(NC)*; U15 3(OUT)*; U18 2(PC13) 3(PC14-OSC32_IN) 4(PC15-OSC32_OUT) 7(PG10-NRST) 11(PA3) 16(PB0) 17(PB1) 18(PB2) 22(PB10) 25(PB11) 39(PA15) 41(PB4) 42(PB5); USBC1 A8(SBU1)* B8(SBU2)*

## Notes on the sheet
- 电源接口
- 滤波电路
- 编码器
- LED电路
- MCU
- 稳压电路
- SWD接口
- 8M晶振
- CAN通讯
- 三相半桥驱动
- 驱动电路
- 按键电路
- 电流采样
